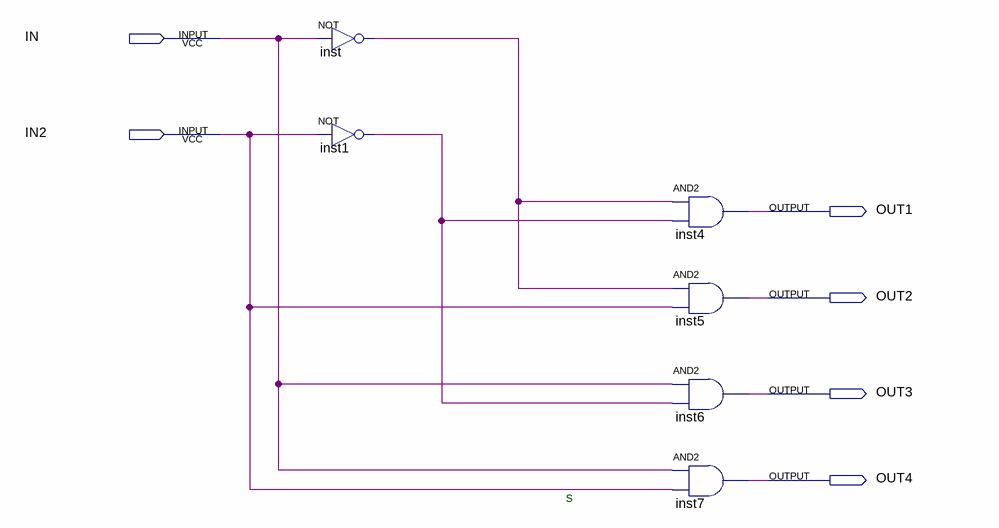
[diagram p0: schematic sheet]
// Quartus schematic decode2_4.bdf as structural Verilog: 6 symbols, 6 pins
module decode2_4 (
  input  IN,
  input  IN2,
  output OUT1,
  output OUT2,
  output OUT3,
  output OUT4
);

  wire inst1_out, inst_out;

  not inst (inst_out, IN);
  not inst1 (inst1_out, IN2);
  and inst4 (OUT1, inst_out, inst1_out);
  and inst5 (OUT2, inst_out, IN2);
  and inst6 (OUT3, IN, inst1_out);
  and inst7 (OUT4, IN, IN2);

  // Notes on the sheet:
  //   s
endmodule
